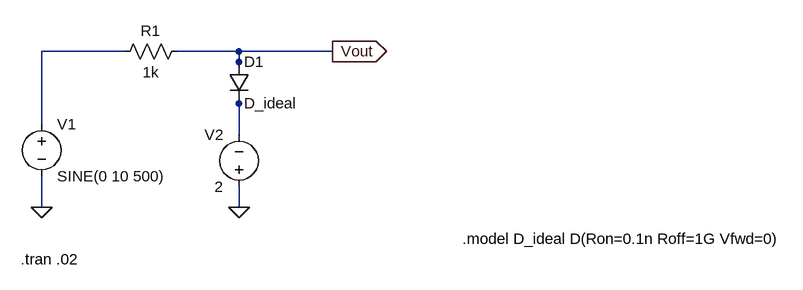
[diagram p0: schematic Draft2.asc]
Draft2.asc, the LTspice schematic file:
Version 4
SHEET 1 1188 680
WIRE 128 0 0 0
WIRE 304 0 208 0
WIRE 448 0 304 0
WIRE 304 16 304 0
WIRE 304 32 304 16
WIRE 304 80 304 64
WIRE 0 112 0 0
WIRE 304 128 304 80
WIRE 0 240 0 192
WIRE 304 240 304 208
FLAG 0 240 0
FLAG 304 240 0
FLAG 448 0 Vout
IOPIN 448 0 Out
SYMBOL voltage 0 96 R0
WINDOW 123 0 0 Left 0
WINDOW 39 0 0 Left 0
SYMATTR InstName V1
SYMATTR Value SINE(0 10 500)
SYMBOL res 224 -16 R90
WINDOW 0 0 56 VBottom 2
WINDOW 3 32 56 VTop 2
SYMATTR InstName R1
SYMATTR Value 1k
SYMBOL diode 288 16 R0
SYMATTR InstName D1
SYMATTR Value D_ideal
SYMBOL voltage 304 224 R180
WINDOW 0 24 96 Left 2
WINDOW 3 24 16 Left 2
WINDOW 123 0 0 Left 0
WINDOW 39 0 0 Left 0
SYMATTR InstName V2
SYMATTR Value 2
TEXT -32 320 Left 2 !.tran .02
TEXT 648 288 Left 2 !.model D_ideal D(Ron=0.1n Roff=1G Vfwd=0)

The netlist it stands for:
* Draft2.asc
V1 N001 0 SINE(0 10 500)
R1 Vout N001 1k
D1 Vout N002 D_ideal
V2 0 N002 2
.model D D
.lib standard.dio
.tran .02
.model D_ideal D(Ron=0.1n Roff=1G Vfwd=0)
.backanno
.end